# Altium schematic sheet ADG726.SchDoc
size A4; SheetNumber: 1; SheetTotal: 1
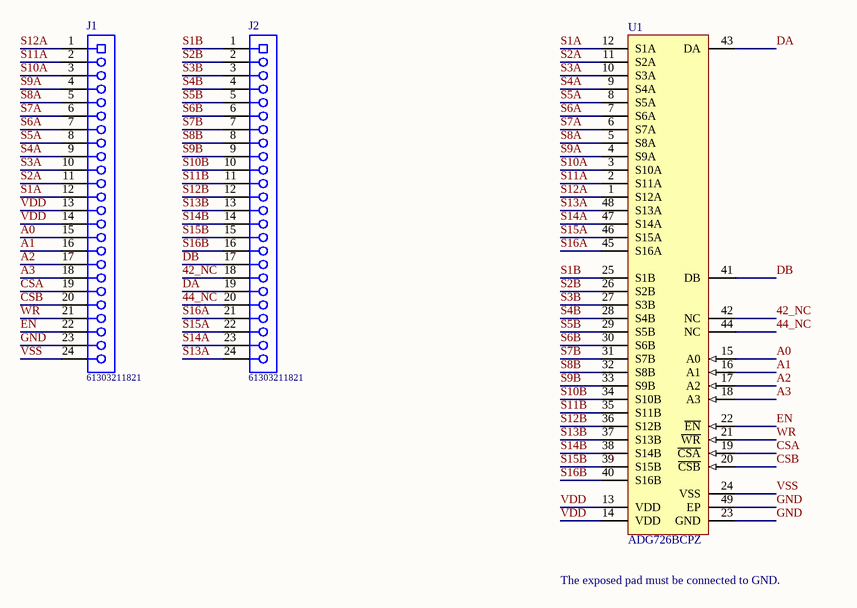
[diagram p0: ADG726.SchDoc]

## Parts
J1  61303211821  [61303211821]
J2  61303211821  [61303211821]
U1  ADG726BCPZ  [ADI-CP-48-1_M]

## Nets
42_NC: J2.18 U1.42(NC)
44_NC: J2.20 U1.44(NC)
A0: J1.15 U1.15(A0)
A1: J1.16 U1.16(A1)
A2: J1.17 U1.17(A2)
A3: J1.18 U1.18(A3)
CSA: J1.19 U1.19(~{CSA})
CSB: J1.20 U1.20(~{CSB})
DA: J2.19 U1.43(DA)
DB: J2.17 U1.41(DB)
EN: J1.22 U1.22(~{EN})
GND: J1.23 U1.23(GND) U1.49(EP)
S1A: J1.12 U1.12(S1A)
S1B: J2.1 U1.25(S1B)
S2A: J1.11 U1.11(S2A)
S2B: J2.2 U1.26(S2B)
S3A: J1.10 U1.10(S3A)
S3B: J2.3 U1.27(S3B)
S4A: J1.9 U1.9(S4A)
S4B: J2.4 U1.28(S4B)
S5A: J1.8 U1.8(S5A)
S5B: J2.5 U1.29(S5B)
S6A: J1.7 U1.7(S6A)
S6B: J2.6 U1.30(S6B)
S7A: J1.6 U1.6(S7A)
S7B: J2.7 U1.31(S7B)
S8A: J1.5 U1.5(S8A)
S8B: J2.8 U1.32(S8B)
S9A: J1.4 U1.4(S9A)
S9B: J2.9 U1.33(S9B)
S10A: J1.3 U1.3(S10A)
S10B: J2.10 U1.34(S10B)
S11A: J1.2 U1.2(S11A)
S11B: J2.11 U1.35(S11B)
S12A: J1.1 U1.1(S12A)
S12B: J2.12 U1.36(S12B)
S13A: J2.24 U1.48(S13A)
S13B: J2.13 U1.37(S13B)
S14A: J2.23 U1.47(S14A)
S14B: J2.14 U1.38(S14B)
S15A: J2.22 U1.46(S15A)
S15B: J2.15 U1.39(S15B)
S16A: J2.21 U1.45(S16A)
S16B: J2.16 U1.40(S16B)
VDD: J1.13 J1.14 U1.13(VDD) U1.14(VDD)
VSS: J1.24 U1.24(VSS)
WR: J1.21 U1.21(~{WR})

## Notes on the sheet
- The exposed pad must be connected to GND.

## Library data of the parts
J1 J2 = Header 1x24: THT Vertical Socket Header WR-PHD, Pitch 2.54 mm, Single Row, 32 pins; Manufacturer: Wurth Elektronik; Rated Current: 3A; Working Voltage: 250VAC; Withstanding Voltage: 500VAC; Gender: Female; Contact Resistance: 20mOhm; Pitch: 2.54mm; Pin Number: 32; Operating Temperature: -40to125degC; Manufacturer URL: http://www.we-online.de; Package Reference: 61303211821; Datasheet URL: https://katalog.we-online.de/em/datasheet/6130xx11821.pdf; Publisher: WurthElektronik; Orientation: Vertical; Mounting Technology: THT; Part Number: 61303211821; Row Number: Single; Packaging: Tray
U1 = CMP-0798-00018-1: 1.8 to 5.5 V / +/-2.5 V, 4 Ohm, 16-Channel Analog Multiplexer, -40 to 85 degC, 48-pin QFN (CP-48-1), Tray; Manufacturer: Analog Devices; Ron (ohms): 4; Supply V Guar Performance: Dual_(+/-2.5V), Single_(+3V), Single_(+5V); Bandwidth (Hz): 34M; Max Analog Signal Range: Vss to Vdd; t transition (s): 23n; PackageDescription: 48-Pin Lead Frame Chip Scale Package, Body 7 x 7 mm, Pitch 0.5 mm; ComponentLink3URL: http:/www.analog.com/static/imported-files/packages/PKG_PDF/LFCSP(CP)/CP-48/CP_48_1.pdf; Code_JEDEC: MO-220-VKKD-2; ComponentLink2Description: Datasheet; PackageReference: CP-48-1; ComponentLink2URL: http://www.analog.com/static/imported-files/data_sheets/ADG726_732.pdf; DatasheetVersion: Rev. 0; PartNumber: ADG726BCPZ; ComponentLink3Description: Package Specification; Packing: Tray; ComponentLink1URL: http://www.analog.com/en/index.html; ComponentLink1Description: Manufacturer URL; Mounting Technology: Surface Mount